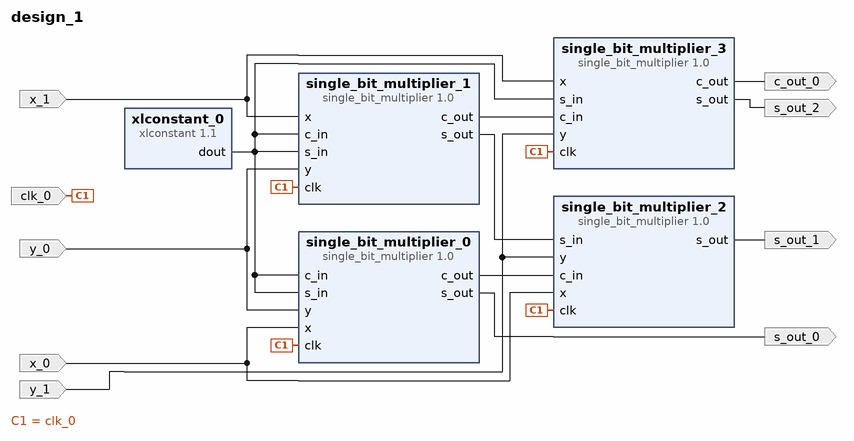
[diagram p0: block diagram of the top level]
# Vivado block design design_1, xc7z020clg484-1, Vivado 2019.2
create_bd_design design_1

create_bd_port -dir I -type clk clk_0
create_bd_port -dir I x_0
create_bd_port -dir I x_1
create_bd_port -dir O s_out_0
create_bd_port -dir O s_out_1
create_bd_port -dir O s_out_2
create_bd_port -dir I y_0
create_bd_port -dir I y_1
create_bd_port -dir O c_out_0

create_bd_cell -type ip -vlnv xilinx.com:user:single_bit_multiplier:1.0 single_bit_multiplier_0
create_bd_cell -type ip -vlnv xilinx.com:user:single_bit_multiplier:1.0 single_bit_multiplier_1
create_bd_cell -type ip -vlnv xilinx.com:user:single_bit_multiplier:1.0 single_bit_multiplier_2
create_bd_cell -type ip -vlnv xilinx.com:user:single_bit_multiplier:1.0 single_bit_multiplier_3
create_bd_cell -type ip -vlnv xilinx.com:ip:xlconstant:1.1 xlconstant_0
set_property -dict {CONFIG.CONST_VAL 0} [get_bd_cells xlconstant_0]

# ---- connections ----

connect_bd_net [get_bd_pins single_bit_multiplier_1/s_out] [get_bd_pins single_bit_multiplier_2/s_in]
connect_bd_net -net clk_0_1 [get_bd_ports clk_0] \
  [get_bd_pins single_bit_multiplier_3/clk] [get_bd_pins single_bit_multiplier_1/clk] \
  [get_bd_pins single_bit_multiplier_2/clk] [get_bd_pins single_bit_multiplier_0/clk]
connect_bd_net -net x_0_1 [get_bd_ports x_0] [get_bd_pins single_bit_multiplier_0/x] [get_bd_pins single_bit_multiplier_2/x]
connect_bd_net -net x_1_1 [get_bd_ports x_1] [get_bd_pins single_bit_multiplier_1/x] [get_bd_pins single_bit_multiplier_3/x]
connect_bd_net [get_bd_pins single_bit_multiplier_0/s_out] [get_bd_ports s_out_0]
connect_bd_net [get_bd_pins single_bit_multiplier_2/s_out] [get_bd_ports s_out_1]
connect_bd_net [get_bd_pins single_bit_multiplier_3/s_out] [get_bd_ports s_out_2]
connect_bd_net [get_bd_pins single_bit_multiplier_0/c_out] [get_bd_pins single_bit_multiplier_2/c_in]
connect_bd_net [get_bd_pins single_bit_multiplier_1/c_out] [get_bd_pins single_bit_multiplier_3/c_in]
connect_bd_net -net y_0_1 [get_bd_ports y_0] [get_bd_pins single_bit_multiplier_0/y] [get_bd_pins single_bit_multiplier_1/y]
connect_bd_net -net y_1_1 [get_bd_ports y_1] [get_bd_pins single_bit_multiplier_2/y] [get_bd_pins single_bit_multiplier_3/y]
connect_bd_net [get_bd_pins xlconstant_0/dout] \
  [get_bd_pins single_bit_multiplier_3/s_in] [get_bd_pins single_bit_multiplier_1/s_in] \
  [get_bd_pins single_bit_multiplier_0/s_in] [get_bd_pins single_bit_multiplier_0/c_in] \
  [get_bd_pins single_bit_multiplier_1/c_in]
connect_bd_net [get_bd_pins single_bit_multiplier_3/c_out] [get_bd_ports c_out_0]

validate_bd_design
save_bd_design
